# Altium schematic sheet IsolationOut.SchDoc
size A
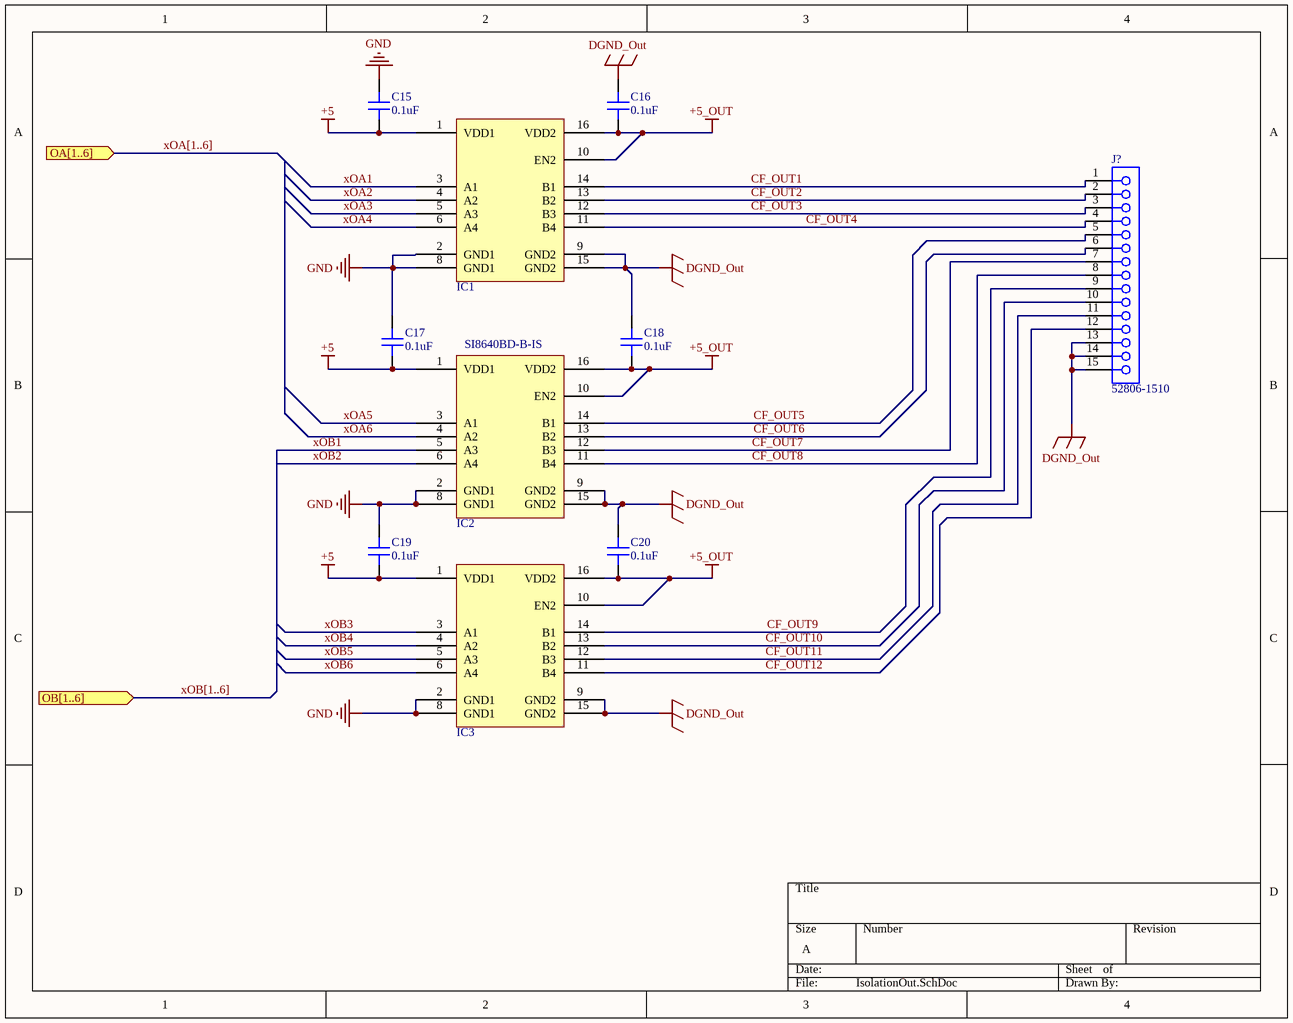
[diagram p0: IsolationOut.SchDoc]

## Parts
C15  0.1uF  [CAP 0805/2012]
C16  0.1uF  [CAP 0805/2012]
C17  0.1uF  [CAP 0805/2012]
C18  0.1uF  [CAP 0805/2012]
C19  0.1uF  [CAP 0805/2012]
C20  0.1uF  [CAP 0805/2012]
IC1  SI8640BD-B-IS  [SI LABS SOIC-16 WIDE]  (value not drawn)
IC2  SI8640BD-B-IS  [SI LABS SOIC-16 WIDE]
IC3  SI8640BD-B-IS  [SI LABS SOIC-16 WIDE]  (value not drawn)
J?  52806-1510  [MOLX-52806-1510]

## Ports
OA[1..6] (in), OB[1..6] (in)

## Nets
+5: C15.1 C17.1 C19.1 IC1.1(VDD1) IC2.1(VDD1) IC3.1(VDD1)
+5_OUT: C16.1 C18.1 C20.1 IC1.10(EN2) IC1.16(VDD2) IC2.10(EN2) IC2.16(VDD2) IC3.10(EN2) IC3.16(VDD2)
DGND_Out: C16.2 C18.2 C20.2 IC1.9(GND2) IC1.15(GND2) IC2.9(GND2) IC2.15(GND2) IC3.9(GND2) IC3.15(GND2) J?.13 J?.14 J?.15
GND: C15.2 C17.2 C19.2 IC1.2(GND1) IC1.8(GND1) IC2.2(GND1) IC2.8(GND1) IC3.2(GND1) IC3.8(GND1)
CF_OUT1: IC1.14(B1) J?.1
CF_OUT2: IC1.13(B2) J?.2
CF_OUT3: IC1.12(B3) J?.3
CF_OUT4: IC1.11(B4) J?.4
CF_OUT5: IC2.14(B1) J?.5
CF_OUT6: IC2.13(B2) J?.6
CF_OUT7: IC2.12(B3) J?.7
CF_OUT8: IC2.11(B4) J?.8
CF_OUT9: IC3.14(B1) J?.9
CF_OUT10: IC3.13(B2) J?.10
CF_OUT11: IC3.12(B3) J?.11
CF_OUT12: IC3.11(B4) J?.12
xOA1: IC1.3(A1)
xOA2: IC1.4(A2)
xOA3: IC1.5(A3)
xOA4: IC1.6(A4)
xOA5: IC2.3(A1)
xOA6: IC2.4(A2)
xOB1: IC2.5(A3)
xOB2: IC2.6(A4)
xOB3: IC3.3(A1)
xOB4: IC3.4(A2)
xOB5: IC3.5(A3)
xOB6: IC3.6(A4)

## Buses and harness runs
bus xOA[1..6] = port OA[1..6]
bus xOB[1..6] = port OB[1..6]

## Library data of the parts
C15-C20 = CL21B104KACNNNC: CAP CER 0.1UF 25V X7R 0805; Manufacturer: Samsung Electro-Mechanics America, Inc.; TemperatureRange: -55C ~ 125C; Tolerance: 10%; Value: 0.1uF; Part Number: CL21B104KACNNNC; PartId: 5699; Supplier 1: Digi-Key; Supplier Part Number 1: 1276-1099-2-ND; ComponentLink1Description: Datasheet; ComponentLink1URL: http://www.samsungsem.com/kr/support/product-search/mlcc/CL21B104KACNNNC.jsp; ComponentLink2Description: Digi-Key listing; ComponentLink2URL: http://digikey.com/product-detail/en/CL21B104KACNNNC/1276-1099-2-ND/3886757; TemperatureCoefficient: X7R; Voltage: 25V; Price: 0.0099; Device Package: 0805 (2012 Metric); Type: -
IC1-IC3 = SI8640BD-B-IS: DGTL ISO 5KV 4CH GEN PURP 16SOIC; Manufacturer: Silicon Labs; Isolated Power: No; Number of Channels: 4; Inputs - Side 1/Side2: 4/0; Channel Type: Unidirectional; Voltage - Isolation: 5000Vrms; Common Mode Transient Immunity (Min): 35kV/us; Data Rate: 150Mbps; Propagation Delay tpLH/tpHL (Max): 13ns, 13ns; Pulse Width Distortion (Max): 4.5ns; Rise / Fall Time (Typ): 2.5ns, 2.5ns; Voltage - Supply: 2.5 V ~ 5.5 V; Part Number: SI8640BD-B-IS; PartId: 14404; Supplier 1: Digi-Key; Supplier Part Number 1: 336-2083-5-ND; ComponentLink1Description: Datasheet; ComponentLink1URL: http://www.silabs.com/Support%20Documents/TechnicalDocs/Si864x.pdf; ComponentLink2Description: Digi-Key Listing; ComponentLink2URL: https://www.digikey.com/product-detail/en/silicon-labs/SI8640BD-B-IS/336-2083-5-ND/2623331; Price: 5.01; Type: General Purpose; Device Package: 16-SOIC (0.295", 7.50mm Width); Operating Temperature: -40C ~ 125C; Technology: Capacitive Coupling
J? = CMP-1242-00172-1: 1.0 mm Pitch FFC Connector, 5.4 mm Mated Height, Vertical, Non-ZIF, Through Hole, 15 Circuits, -20 to 80 degC, ELV and RoHS Compliant, Tray; Manufacturer: Molex; Voltage (Max): 50V AC (RMS)/DC; Pitch - Mating Interface: 1.00mm; Circuits (maximum): 15; Durability (mating cycles max): 10; Stackable: No; Current (Max per Contact): 0.5A; Mated Height: 5.40mm; Material - Plating Mating: Tin; PCB Retention: None; Material - Metal: Phosphor Bronze; ComponentLink3URL: http://www.molex.com/pdm_docs/sd/528061510_sd.pdf; PartNumber: 52806-1510; ComponentLink2URL: http://www.molex.com/webdocs/datasheets/pdf/en-us/0528061510_FFC_FPC_CONNECTORS.pdf; PackageVersion: Rev. B, 08/2002; Pitch - Termination Interface: 1.00mm; Circuits (Loaded): 15; PackageDescription: 15-Lead FFC Connector, Pitch 1.0 mm; ComponentLink1URL: http://www.molex.com/molex/index.jsp; Packing: Tray; ComponentLink1Description: Manufacturer URL; Entry Angle: Vertical; Contact Position: N/A; PCB Locator: No; Number of Rows: 1; ComponentLink2Description: Datasheet; Material - Plating Termination: Tin; Orientation: Vertical; RoHS: TRUE; PackageReference: 52806-1510; ComponentLink3Description: Package Specification; Mounting Technology: Through Hole; Polarized to PCB: No